# Altium schematic sheet IMU.SchDoc
size A; SheetNumber: 7
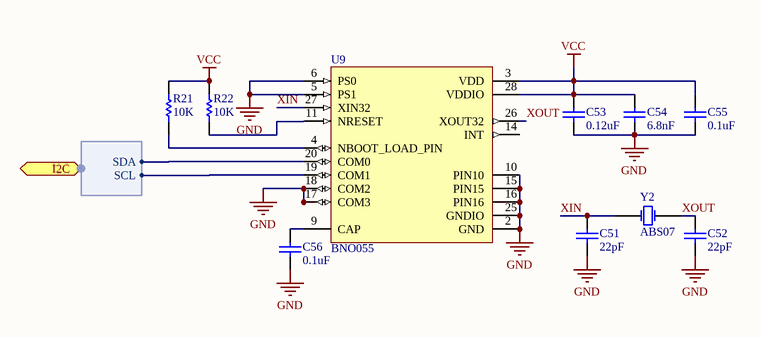
[diagram p0: IMU.SchDoc]

## Parts
C51  value 22pF  [C0402[1005X55]]  (hidden comment: 22pF 50V 0402)
C52  value 22pF  [C0402[1005X55]]  (hidden comment: 22pF 50V 0402)
C53  value 0.12uF  [C0402[1005X55]]  (hidden comment: 0.12uF 6.3V 0402)
C54  value 6.8nF  [C0402[1005X55]]  (hidden comment: 6.8nF 50V 0402)
C55  value 0.1uF  [C0402[1005X55]]  (hidden comment: 0.1uF 6.3V 0402)
C56  value 0.1uF  [C0402[1005X55]]  (hidden comment: 0.1uF 6.3V 0402)
R21  value 10K  [R0402[1005]]  (hidden comment: 10K 1% 0402)
R22  value 10K  [R0402[1005]]  (hidden comment: 10K 1% 0402)
U9  BNO055  [LGA28R50P4X10_380X520X100]
Y2  ABS07  [ABS07]

## Ports
I2C (harness I2C)

## Harnesses
I2C: SCL, SDA

## Nets
GND: C51.1 C52.1 C53.1 C54.1 C55.1 C56.1 U9.2(GND) U9.5(PS1) U9.6(PS0) U9.10(PIN10) U9.15(PIN15) U9.16(PIN16) U9.17(COM3) U9.18(COM2) U9.25(GNDIO)
VCC: C53.2 C54.2 C55.2 R21.2 R22.2 U9.3(VDD) U9.28(VDDIO)
XIN: C51.2 U9.27(XIN32) Y2.1(X1)
XOUT: C52.2 U9.26(XOUT32) Y2.2(X2)
NetC56_2: C56.2 U9.9(CAP)
NetR21_1: R21.1 U9.4(NBOOT_LOAD_PIN)
NetR22_1: R22.1 U9.11(NRESET)
NetU9_19: U9.19(COM1) ; port I2C.SCL
NetU9_20: U9.20(COM0) ; port I2C.SDA

Not connected (* = marked no-connect by the designer): U9 14(INT)

## Library data of the parts
C51 C52 = CAP_22pF_50V_0402_1%: 22pF 50V 1% 0402 (1005 Metric); PartNumber: GRM1555C1H220FA01D; Manufacturer: Murata; Tolerance: 1%; Mounting Technology: Surface Mount; PackageReference: 0402; PackageDescription: 0402 (1005 Metric); Voltage: 50V
C53 = CAP_0.12uF_6.3V_0402_10%: 0.12uF 6.3V 10% 0402 (1005 Metric); PartNumber: GRM155R60J124KE01D; Manufacturer: Murata; Tolerance: 10%; Mounting Technology: Surface Mount; PackageReference: 0402; PackageDescription: 0402 (1005 Metric); Voltage: 6.3V
C54 = CAP_6.8nF_50V_0402_10%: 6.8nF 50V 10% 0402 (1005 Metric); PartNumber: GRM155R71H682KA88J; Manufacturer: Murata; Tolerance: 10%; Mounting Technology: Surface Mount; PackageReference: 0402; PackageDescription: 0402 (1005 Metric); Voltage: 50V
C55 C56 = CAP_0.1uF_6.3V_0402_10%: 0.1uF 6.3V 10% 0402 (1005 Metric); PartNumber: GRM155R70J104KA01D; Manufacturer: Murata; Tolerance: 10%; Mounting Technology: Surface Mount; PackageReference: 0402; PackageDescription: 0402 (1005 Metric); Voltage: 6.3V
R21 R22 = RES_10K_0402_1%: 10K 0.063W 1% 0402 (1005 Metric); Manufacturer: KOA Speer; PartNumber: RK73H1ETTP1002F; Tolerance: 1%; Power: 0.063W; Mounting Technology: Surface Mount; PackageReference: 0402; PackageDescription: 0402 (1005 Metric); ComponentLink1Description: Datasheet; ComponentLink1URL: http://www.koaspeer.com/catimages/Products/RK73H/RK73H.pdf
Y2 = ABS07: Manufacturer: Abracon; PartNumber: ABS07-32.768KHZ-T; Mounting Technology: Surface Mount; PackageReference: 2-SMD
U9 = BNO055: Value: *